# Altium project Power Supply.PrjPcb
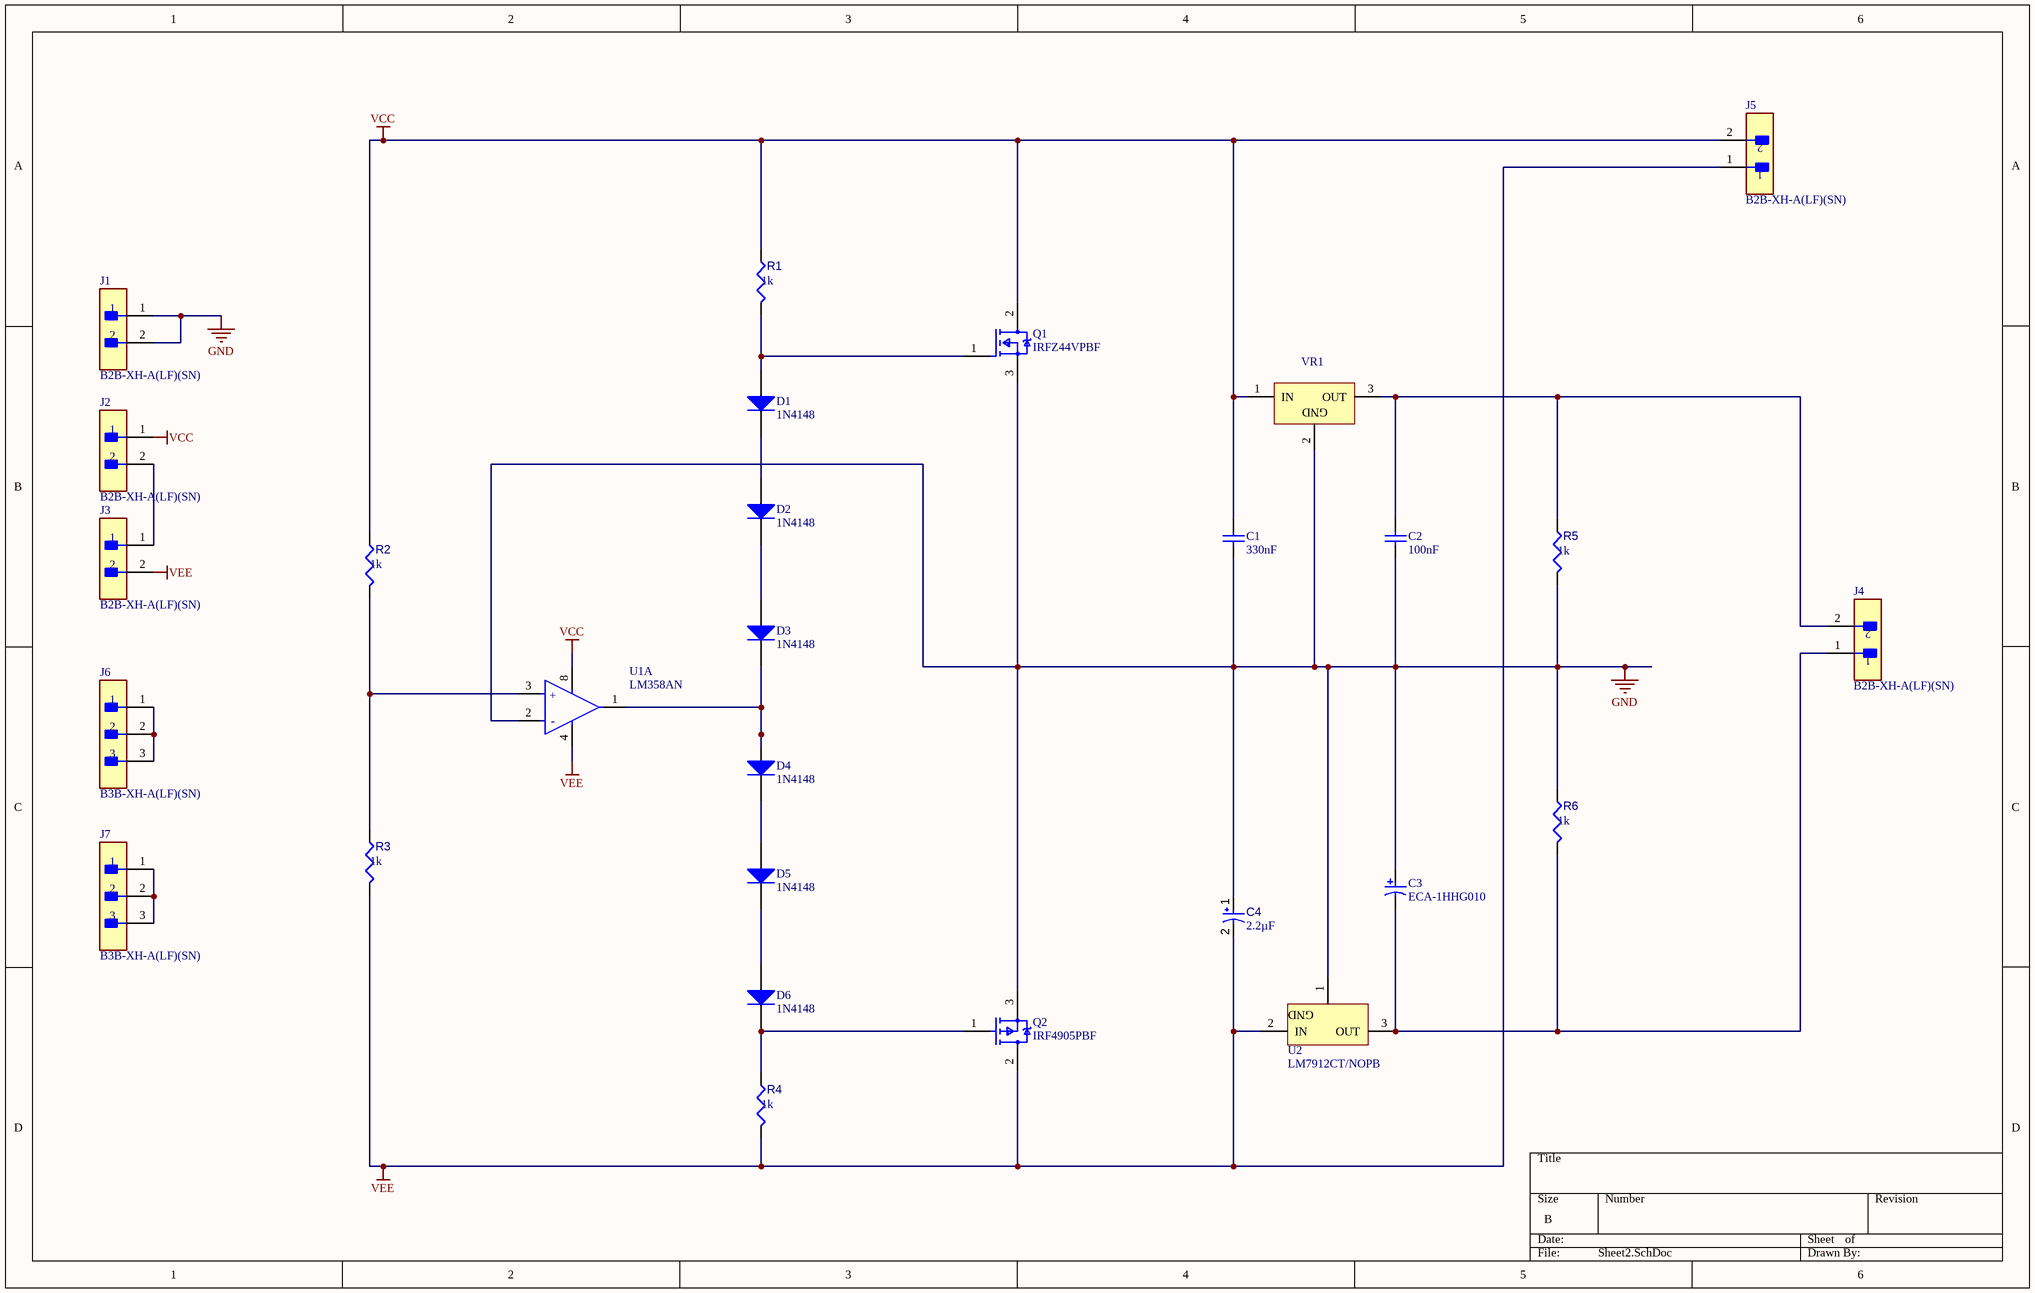
[diagram p0: Sheet2.SchDoc]
1 sheet, 28 parts. Net scope: global (net labels, ports and power ports of the same name join across sheets).
Board file: PCB2.PcbDoc

## Sheet Sheet2.SchDoc
size B; SheetNumber: 1; SheetTotal: 1

### Parts
C1  330nF  [KEMT-C315-THT-2]
C2  100nF  [KEMT-C315-THT-2]
C3  ECA-1HHG010  [CAPPR55-200-1100X500X1200]
C4  value 2.2µF  [CAPPR55-200-1100X500X1200]  (hidden comment: ECA1HM2R2)
D1  1N4148  [NXP-SOD27-2_V]
D2  1N4148  [NXP-SOD27-2_V]
D3  1N4148  [NXP-SOD27-2_V]
D4  1N4148  [NXP-SOD27-2_V]
D5  1N4148  [NXP-SOD27-2_V]
D6  1N4148  [NXP-SOD27-2_V]
J1  B2B-XH-A(LF)(SN)  [FP-B2B-XH-A_LF_SN-MFG]
J2  B2B-XH-A(LF)(SN)  [FP-B2B-XH-A_LF_SN-MFG]
J3  B2B-XH-A(LF)(SN)  [FP-B2B-XH-A_LF_SN-MFG]
J4  B2B-XH-A(LF)(SN)  [FP-B2B-XH-A_LF_SN-MFG]
J5  B2B-XH-A(LF)(SN)  [FP-B2B-XH-A_LF_SN-MFG]
J6  B3B-XH-A(LF)(SN)  [FP-B3B-XH-A_LF_SN-MFG]
J7  B3B-XH-A(LF)(SN)  [FP-B3B-XH-A_LF_SN-MFG]
Q1  IRFZ44VPBF  [FP-PG-TO220-3-MFG]
Q2  IRF4905PBF  [FP-PG-TO220-3-MFG]
R1  value 1k  [RESA60-630X240]  (hidden comment: CFR-25JB-52-470K)
R2  value 1k  [RESA60-630X240]  (hidden comment: CFR-25JB-52-470K)
R3  value 1k  [RESA60-630X240]  (hidden comment: CFR-25JB-52-470K)
R4  value 1k  [RESA60-630X240]  (hidden comment: CFR-25JB-52-470K)
R5  value 1k  [RESA60-630X240]  (hidden comment: CFR-25JB-52-470K)
R6  value 1k  [RESA60-630X240]  (hidden comment: CFR-25JB-52-470K)
U1  LM358AN  [FP-626-05-MFG]  (part A of 2)
U2  LM7912CT/NOPB  [NDE0003A]
VR1  L7805CV  [TO220]  (value not drawn)

### Nets
GND: C1.1 C2.1 C3.1 C4.1 J1.1 J1.2 Q1.3(SOURCE) Q2.3(SOURCE) R5.2 R6.1 U1.2(IN1(-)) U2.1(GND) VR1.2(GND)
VCC: C1.2 J2.1 J5.2 Q1.2(DRAIN) R1.1 R2.1 U1.8(VCC) VR1.1(IN)
VEE: C4.2 J3.2 J5.1 Q2.2(DRAIN) R3.2 R4.2 U1.4(GND) U2.2(IN)
NetC2_2: C2.2 J4.2 R5.1 VR1.3(OUT)
NetC3_2: C3.2 J4.1 R6.2 U2.3(OUT)
NetD1_1: D1.1(A) Q1.1(GATE) R1.2
NetD1_2: D1.2(K) D2.1(A)
NetD2_2: D2.2(K) D3.1(A)
NetD3_2: D3.2(K) D4.1(A) U1.1(OUT1)
NetD4_2: D4.2(K) D5.1(A)
NetD5_2: D5.2(K) D6.1(A)
NetD6_2: D6.2(K) Q2.1(GATE) R4.1
NetJ2_2: J2.2 J3.1
NetJ6_1: J6.1 J6.2 J6.3
NetJ7_1: J7.1 J7.2 J7.3
NetR2_2: R2.2 R3.1 U1.3(IN1(+))

### Notes on the sheet
- (in symbol CMP-07106-000007-1, part A) +; -

### Library data of the parts
C1 C2 = CMP-1664-00008-1: Capacitor, Ceramic, 22 pF, +/-10 %, 100 V, -55 to 125 degC, 2-Pin THD, RoHS, Bulk; Max Input Voltage: 40 V; Min Input Voltage: 4.2 V; Output Current: 1.5 A; Output Voltage: 1.2 V; Outputs: 1; Case\Package: TO-220; RoHSCompliant: true; Min Operating Temperature: 0 degC; Max Operating Temperature: 125 degC; Package Quantity: 50; ComponentLink2URL: http://capacitoredge.kemet.com/capedge2/DataSheet/Datasheet-C315C220K1G5TA.pdf?pn=C315C220K1G5TA{BULK}; Radiation Hardening: No; Pins: 3; Length: 10.28 mm; ComponentLink1URL: http://www.kemet.com/; ComponentLink2Description: Datasheet; Height: 9.28 mm; REACH SVHC: No SVHC; ComponentLink1Description: Manufacturer URL; Max Ouput Current: 1.5 A; Weight: 0.08113 oz; Packaging: Rail/Tube; DatasheetVersion: Aug-16; Mount: Through Hole; PackageReference: C315-THT-2; Width: 4.82 mm; PackageDescription: 2-Pin Through Hole Device, Body 3.81 x 2.54 mm
C3 = CMP-1665-00039-1: Aluminum Electrolytic Capacitor, 1 uF, +/- 20%, 50 V, -55 to 105 degC, 2-Pin THD, RoHS, Bulk; Channels: 2; ComponentLink1Description: Manufacturer URL; ComponentLink2Description: Datasheet; ComponentLink2URL: https://datasheet.ciiva.com/7275/94060-7275472.pdf; PackageDescription: 2-Pin Radial Lead, Dia 5 mm, Body Length 11 mm; PackageReference: CAPPR55-200-1100X500X1200; Mount: Through Hole; Radiation Hardening: No; ComponentLink1URL: http://www.panasonic.com/; Min Operating Temperature: -30 degC; Package Quantity: 150; Max Operating Temperature: 70 degC; DatasheetVersion: Mar-05; RoHSCompliant: true; Packaging: Bulk
C4 = CMP-001-00029-7: Aluminum Electrolytic Capacitor, 2.2 uF, +/- 20%, 50 V, -40 to 85 degC, 2-Pin THD, RoHS, Bulk; Manufacturer: Panasonic; Voltage Rating: 50V; Ripple Current: 20mA; Package Description: 2-Pin Radial Lead, Dia 5 mm, Height 12 mm; Manufacturer URL: http://www.panasonic.com/; Tolerance: 20%; Diameter: 5mm; Pins: 2; Mounting Technology: TH; Capacitor Type: Electrolytic; RoHS Compliant: True; Min Operating Temperature: -40°C; Case/Package: Radial; Datasheet URL: https://industrial.panasonic.com/cdbs/www-data/pdf/RDF0000/ABA0000C1218.pdf; Lead Pitch: 2mm; Max Operating Temperature: 85°C; Packaging: Bulk; Package Reference: CAPPR55-200-1100X500X1200; Datasheet Version: Rev. 05, 10/2016; Ripple Current (AC): 20mA; Package Quantity: 200
D1-D6 = CMP-004-00000-2: High Speed Diode, 100 V, 0.45 A, -65 to 175 degC, 2-Pin SOD27, RoHS, Bulk; Manufacturer: Fairchild; Elements: 1; Recovery Time: 4ns; Forward Current: 300mA; Power: 500mW; Forward Voltage: 1V; Max Surge Current: 4A; Peak Reverse Current: 5uA; Datasheet URL: http://www.nxp.com/documents/data_sheet/1N4148_1N4448.pdf; Min Operating Temperature: -65°C; Manufacturer URL: https://www.fairchildsemi.com/; Packaging: Bulk; Diameter: 1.91mm; Pins: 2; Package URL: http://www.nxp.com/documents/data_sheet/1N4148_1N4448.pdf; Package Reference: SOD27; Max Operating Temperature: 175°C; Package Quantity: 2000; Case/Package: DO; Datasheet Version: Aug-04; RoHS Compliant: True
J1-J5 = CMP-2000-05888-3: CONN HEADER VERT 2POS 2.5MM; Current Rating: 3A; Voltage Rating: 250V; Number of Contacts: 2; Contact Resistance: 20mR; Wire/Cable Gauge: 22AWG; Insulation Resistance: 1GR; Connector Type: Male Pin; Packaging: Bulk; Contact Material: Brass; Lead Free: Lead Free; Orientation: Straight; Contact Plating: Tin; Max Current Rating: 3A; Termination: Solder; Fastening Type: Detent; Depth: 5.75mm; Housing Material: Polyamide; REACH SVHC: No SVHC; Series: XH; Voltage Rating (AC): 250V; Number of Positions: 2; Color: Natural; Contact Type: Male Pin; Max Voltage Rating (DC): 250V; Pitch: 2.5mm; Lead Pitch: 2.5mm; Mount: Through Hole; Max Operating Temperature: 85°C; Length: 7.4mm; Max Voltage Rating (AC): 250V; Min Operating Temperature: -25°C; Number of Rows: 1; Housing Color: White
J6 J7 = CMP-17439-000014-3: CONN HEADER VERT 3POS 2.5MM; Max Voltage Rating (DC): 250V; Number of Positions: 3; Current Rating: 3A; Gender: Male; Wire/Cable Gauge: 22AWG; Contact Resistance: 20mR; Insulation Resistance: 1GR; Insulation Material: Nylon; Contact Plating: Tin; Depth: 5.75mm; Contact Type: Male Pin; Max Operating Temperature: 85°C; Insulation Color: Natural; Voltage Rating (AC): 250V; Color: Natural; Connector Type: Header; Orientation: Straight; Fastening Type: Detent; Housing Color: White; Min Operating Temperature: -25°C; Termination: Solder; Voltage Rating: 250V; Series: XH; Pitch: 2.5mm; Contact Shape: Square; Number of Rows: 1; Lead Free: Lead Free; Packaging: Bulk; Mount: Through Hole; Flammability Rating: UL94 V-0; Max Voltage Rating (AC): 250V; REACH SVHC: No SVHC; Housing Material: Polyamide; Contact Material: Brass; Lead Pitch: 2.5mm; Contact Finish - Mating: TIN; Length: 9.9mm; Max Current Rating: 3A; Number of Contacts: 3
Q1 = CMP-32901-001154-1: MOSFET N-CH 60V 55A TO220AB; Polarization: N; Power Dissipation: 115W; Rds On Max: 16.5mR; Gate to Source Voltage (Vgs): 20V; Threshold Voltage: 4V; Turn-On Delay Time: 13ns; Element Configuration: Single; Input Capacitance: 1.812nF; Turn-Off Delay Time: 40ns; Mount: Through Hole; Drain to Source Voltage (Vdss): 60V; Max Dual Supply Voltage: 60V; Length: 0.42inch; Height: 0.65inch; Width: 0.19inch; Packaging: Rail/Tube; Halogen Free: Halogen Free; Number of Pins: 3; Continuous Drain Current (ID): 55A; Drain to Source Resistance: 16.5mR; Series: HEXFET®; RoHS Compliant: Yes; Reach SVHC Compliant: Yes; Drain to Source Breakdown Voltage: 60V; Max Operating Temperature: 175°C; Case/Package: TO-220; Max Power Dissipation: 115W; Lead Free: Lead Free; Min Operating Temperature: -55°C
Q2 = CMP-32901-000200-1: MOSFET P-CH 55V 74A TO-220AB; Drain to Source Resistance: 20mR; Input Capacitance: 3.4nF; Max Dual Supply Voltage: -55V; Power Dissipation: 200W; Turn-On Delay Time: 18ns; Element Configuration: Single; Threshold Voltage: -4V; Gate to Source Voltage (Vgs): 20V; Turn-Off Delay Time: 61ns; Number of Pins: 3; Packaging: Rail/Tube; RoHS Compliant: Yes; REACH SVHC: No SVHC; Halogen Free: Halogen Free; Max Power Dissipation: 200W; Drain to Source Breakdown Voltage: -55V; Length: 0.414inch; Drain to Source Voltage (Vdss): -55V; Height: 0.6inch; Case/Package: TO-220; Width: 0.185inch; Continuous Drain Current (ID): 74A; Mount: Through Hole; Min Operating Temperature: -55°C; Lead Free: Lead Free; Max Operating Temperature: 175°C; Rds On Max: 20mR
R1-R6 = CMP-009-00055-4: RES 470K OHM 5% 1/4W AXIAL; Manufacturer: Yageo; Power: 250mW; Voltage Rating: 250V; Tolerance: 1%; Case/Package: Axial; Mounting Technology: TH; RoHS Compliant: True; Package Description: 2-Pin Axial Lead, Dia 2.4 mm, Body Length 6.3 mm; Min Operating Temperature: -55°C; Datasheet URL: http://www.yageo.com/documents/recent/Yageo%20LR_MFR_2013.pdf; Manufacturer URL: http://www.yageo.com/; Package Quantity: 200; Package Reference: MFR-25; Max Operating Temperature: 155°C; Datasheet Version: Apr-13; Packaging: Bulk
U1 = CMP-07106-000007-1: IC OPAMP GP 2 CIRCUIT 8DIP; Manufacturer: ON Semiconductor; Input Bias Current: 0.045uA; Max Junction Temp: +150°C; Nominal Supply Current: 0.5-0.8mA; Max Supply Voltage: 32V; Min Supply Voltage: 3V; Input Offset Voltage: 2mV; Voltage Gain: 100dB; Output Current Per Channel: 100-15000uA; Standoff Height: 0.38mm; Number Of Channels: 2; Min Dual Supply Voltage: 1.5V; Max Dual Supply Voltage: 16V; Ipc Land Pattern Name: DIP794W46P254L1016H533Q8; Lead Free: Yes; Manufacturer Part Number: LM358AN; Device Class L2: Linear ICs; ComponentLink2Description: Datasheet; Octopart: https://octopart.com/lm358an-on+semiconductor-84329698; Category: IC; ComponentLink2URL: https://www.onsemi.com/pub/Collateral/LM358A-D.pdf; Device Class L3: Amplifiers - Op Amps; Footprint Url: https://www.onsemi.com/pub/Collateral/626-05.PDF; Temperature: 0°C to +70°C; Mouser Description: Operational Amplifiers - Op Amps DIP-8 Dual Op Amp; Device Class L1: Integrated Circuits (ICs); Height: 5.33mm; RoHS: TRUE; Temperature Range Low: 0°C; Temperature Range High: +70°C; Automotive: No; Digikey Description: IC OPAMP GP 2 CIRCUIT 8DIP; Package: 626-05
U2 = CMP-0062-02473-3: 3-Terminal Negative Regulator, 3-pin TO-220, Pb-Free; Manufacturer: Texas Instruments; PackageTopMarking: NSUZXYTTE#*LM7912CT; CompType: LDO IC; PowerWise: N; RoHS: Y; PackageDescription: TO-220, Molded, 3 Lead, Straight; PackageReference: NDE0003A; PinCount: 3; ComponentLink1URL: http://www.ti.com/general/docs/lit/getliterature.tsp?genericPartNumber=LM7912&fileType=pdf; ComponentLink1Description: Datasheet URL
VR1 = CMP-019-00018-3: Manufacturer: STMicroelectronics; Max Input Voltage: 35V; Min Supply Voltage: 8V; Nominal Output Voltage: 5V; Outputs: 1; Output Current: 1.5A; Dropout Voltage: 2V; Max Supply Voltage: 20V; Min Input Voltage: 7V; Datasheet Version: Rev 30, 09/2012; Min Operating Temperature: 0°C; Manufacturer URL: http://www.st.com/; Pins: 3; Mounting Technology: TH; Output Voltage: 5V; RoHS Compliant: True; Max Ouput Current: 1.5A; Datasheet URL: https://datasheet.ciiva.com/15111/getdatasheetpartid-44136-15111027.pdf; Packaging: Rail/Tube; Max Operating Temperature: 125°C; Case/Package: TO-220; Package Quantity: 50